# EAGLE design ESP32_LoRa_1_Channel_Gateway (EAGLE 9.6.2)
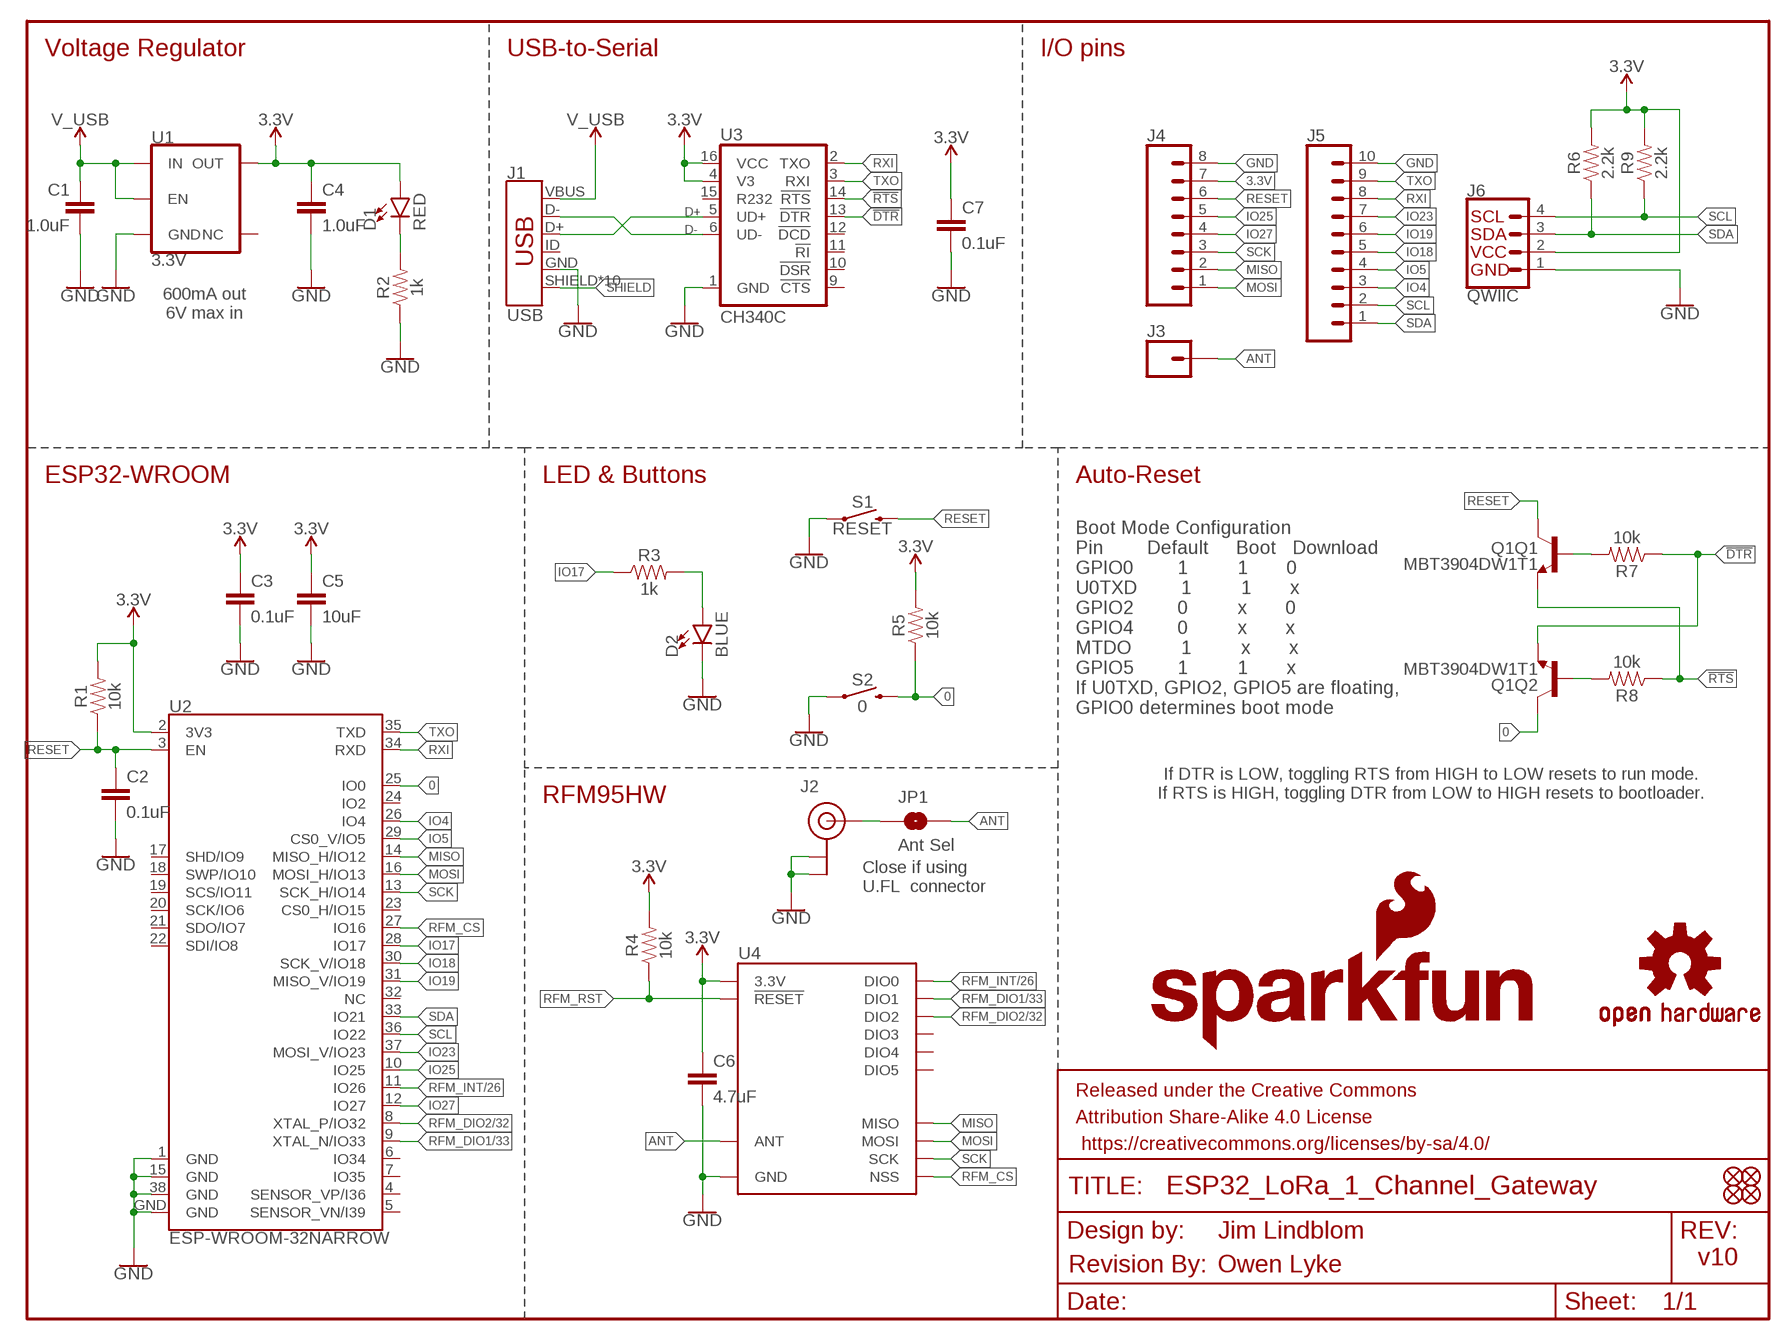
[diagram p0: schematic, sheet 1]

## Parts
C1  1.0uF  1.0UF-0603-16V-10%  [0603]
C2  0.1uF  0.1UF-0603-25V-(+80/-20%)  [0603]
C3  0.1uF  0.1UF-0603-25V-(+80/-20%)  [0603]
C4  1.0uF  1.0UF-0603-16V-10%  [0603]
C5  10uF  10UF-0603-6.3V-20%  [0603]
C6  4.7uF  4.7UF-0603-6.3V-(10%)  [0603]
C7  0.1uF  0.1UF-0603-25V-5%  [0603]
D1  RED  LED-RED0603  [LED-0603]
D2  BLUE  LED-BLUE0603  [LED-0603]
FD1  FIDUCIAL1X2  [FIDUCIAL-1X2]
FD2  FIDUCIAL1X2  [FIDUCIAL-1X2]
FD3  FIDUCIAL1X2  [FIDUCIAL-1X2]
FD4  FIDUCIAL1X2  [FIDUCIAL-1X2]
FRAME1  FRAME-LETTER  [CREATIVE_COMMONS]
J1  USB  USB_MICRO-B_HALF_PTH_MILL  [USB-MICROB-PTH-MILL]
J2  U.FL  [U.FL]
J3  CONN_01PTH_NO_SILK_YES_STOP  [1X01_NO_SILK]
J4  CONN_08NO_SILK_FEMALE_PTH  [1X08_NO_SILK]
J5  CONN_10NO_SILK_PTH_FEMALE  [1X10_NO_SILK]
J6  QWIIC  QWIIC_CONNECTORJS-1MM  [1X04_1MM_RA]
JP1  Ant Sel  JUMPER-SMT_2_NO_NO-SILK  [SMT-JUMPER_2_NO_NO-SILK]
LOGO1  REVISION  [REVISION]
LOGO2  SFE_LOGO_NAME_FLAME.1_INCH  [SFE_LOGO_NAME_FLAME_.1]
LOGO3  OSHW-LOGOS  [OSHW-LOGO-S]
Q1  MBT3904DW1T1  TRANS_NPN_DUAL-MBT3904DW1T1  [SC70-6]
R1  10k  10KOHM-0603-1/10W-1%  [0603]
R2  1k  1KOHM-0603-1/10W-1%  [0603]
R3  1k  1KOHM-0603-1/10W-1%  [0603]
R4  10k  10KOHM-0603-1/10W-1%  [0603]
R5  10k  10KOHM-0603-1/10W-1%  [0603]
R6  2.2k  2.2KOHM-0603-1/10W-1%  [0603]
R7  10k  10KOHM-0603-1/10W-1%  [0603]
R8  10k  10KOHM-0603-1/10W-1%  [0603]
R9  2.2k  2.2KOHM-0603-1/10W-1%  [0603]
S1  RESET  MOMENTARY-SWITCH-SPST-SMD-4.6X2.8MM  [TACTILE_SWITCH_SMD_4.6X2.8MM]
S2  0  MOMENTARY-SWITCH-SPST-SMD-4.6X2.8MM  [TACTILE_SWITCH_SMD_4.6X2.8MM]
U1  3.3V  V_REG_AP2112K-3.3V  [SOT23-5]
U2  ESP-WROOM-32NARROW  [ESP-WROOM-32-NARROW]
U3  CH340C  [SO016]
U4  RFM95W  [RFM95/96/97/98W]

## Nets
0: Q1.6(Q2:C) R5.1 S2.3 S2.4 U2.25(IO0)
3.3V: C3.1 C4.1 C5.1 C6.1 C7.1 D1.A J4.7 J6.2 R1.2 R4.2 R5.2 R6.2 R9.2 U1.5(OUT) U2.2(3V3) U3.4(V3) U3.16(VCC) U4.3.3V
!DTR: Q1.1(Q2:E) R7.1 U3.13(!DTR)
!RTS: Q1.4(Q1:E) R8.1 U3.14(!RTS)
ANT: J3.1 JP1.2 U4.ANT
D+: J1.D+ U3.5(UD+)
D-: J1.D- U3.6(UD-)
GND: C1.2 C2.2 C3.2 C4.2 C5.2 C6.2 C7.2 D2.C J1.GND J2.1(GND) J2.2(GND) J4.8 J5.10 J6.1 R2.1 S1.1 S1.2 S2.1 S2.2 U1.2(GND) U2.1(GND) U2.15(GND) U2.38(GND) U2.GND U3.1(GND) U4.GND@1(GND) U4.GND@2(GND) U4.GND@3(GND)
IO4: J5.3 U2.26(IO4)
IO5: J5.4 U2.29(CS0_V/IO5)
IO17: R3.1 U2.28(IO17)
IO18: J5.5 U2.30(SCK_V/IO18)
IO19: J5.6 U2.31(MISO_V/IO19)
IO23: J5.7 U2.37(MOSI_V/IO23)
IO25: J4.5 U2.10(IO25)
IO27: J4.4 U2.12(IO27)
MISO: J4.2 U2.14(MISO_H/IO12) U4.MISO
MOSI: J4.1 U2.16(MOSI_H/IO13) U4.MOSI
N$1: D1.C R2.2
N$2: D2.A R3.2
N$3: J2.FEED(SIGNAL) JP1.1
N$10: Q1.5(Q1:B) R7.2
N$12: Q1.2(Q2:B) R8.2
RESET: C2.1 J4.6 Q1.3(Q1:C) R1.1 S1.3 S1.4 U2.3(EN)
RFM_CS: U2.27(IO16) U4.NSS
RFM_DIO1/33: U2.9(XTAL_N/IO33) U4.DIO1
RFM_DIO2/32: U2.8(XTAL_P/IO32) U4.DIO2
RFM_INT/26: U2.11(IO26) U4.DIO0
RFM_RST: R4.1 U4.!RESET
RXI: J5.8 U2.34(RXD) U3.2(TXO)
SCK: J4.3 U2.13(SCK_H/IO14) U4.SCK
SCL: J5.2 J6.4 R9.1 U2.36(IO22)
SDA: J5.1 J6.3 R6.1 U2.33(IO21)
SHIELD: J1.SHIELD J1.SHIELD2(SHIELD) J1.SHIELD3(SHIELD) J1.SHIELD4(SHIELD) J1.SHIELD5(SHIELD) J1.SHIELD6(SHIELD) J1.SHIELD7(SHIELD) J1.SHIELD8(SHIELD) J1.SHIELD9(SHIELD) J1.SHIELD10(SHIELD)
TXO: J5.9 U2.35(TXD) U3.3(RXI)
V_USB: C1.1 J1.VBUS U1.1(IN) U1.3(EN)
Unconnected: J1.ID U1.4(NC) U2.4(SENSOR_VP/I36) U2.5(SENSOR_VN/I39) U2.6(IO34) U2.7(IO35) U2.17(SHD/IO9) U2.18(SWP/IO10) U2.19(SCS/IO11) U2.20(SCK/IO6) U2.21(SDO/IO7) U2.22(SDI/IO8) U2.23(CS0_H/IO15) U2.24(IO2) U2.32(NC) U3.9(!CTS) U3.10(!DSR) U3.11(!RI) U3.12(!DCD) U3.15(R232) U4.DIO3 U4.DIO4 U4.DIO5

## Notes on the sheet
- Voltage Regulator | USB-to-Serial | I/O pins
- 600mA out
  6V max in
- ESP32-WROOM | LED & Buttons | Auto-Reset
- Boot Mode Configuration
  Pin        Default     Boot   Download
  GPIO0        1         1       0
  U0TXD        1         1       x
  GPIO2        0         x       0
  GPIO4        0         x       x
  MTDO         1         x       x
  GPIO5        1         1       x
  If U0TXD, GPIO2, GPIO5 are floating, 
  GPIO0 determines boot mode
- If DTR is LOW, toggling RTS from HIGH to LOW resets to run mode.
  If RTS is HIGH, toggling DTR from LOW to HIGH resets to bootloader.
- RFM95HW
- Close if using
  U.FL  connector
- Jim Lindblom
- v10
- Owen Lyke

## Library data of the parts
C1 C4 = SparkFun-Capacitors:1.0UF: 1µF ceramic capacitors A capacitor is a passive two-terminal electrical component used to store electrical energy temporarily in an electric field.; PROD_ID: CAP-00868
C2 C3 = SparkFun-Capacitors:0.1UF: 0.1µF ceramic capacitors A capacitor is a passive two-terminal electrical component used to store electrical energy temporarily in an electric field.; PROD_ID: CAP-00810
C5 = SparkFun-Capacitors:10UF: 10.0µF ceramic capacitors A capacitor is a passive two-terminal electrical component used to store electrical energy temporarily in an electric field.; PROD_ID: CAP-11015
C6 = SparkFun-Capacitors:4.7UF: 4.7µF ceramic capacitors A capacitor is a passive two-terminal electrical component used to store electrical energy temporarily in an electric field.; PROD_ID: CAP-08280
C7 = SparkFun-Capacitors:0.1UF: 0.1µF ceramic capacitors A capacitor is a passive two-terminal electrical component used to store electrical energy temporarily in an electric field.; PROD_ID: CAP-08604
D1 = SparkFun-LED:LED-RED: Red SMD LED Used in manufacturing of most products at SparkFun Packages: 0603 - SMD 0603 package [Product Link] <http://docs.avagotech.com/docs/AV02-0551EN> 0603 SMART - SMD 0603 SMART package ( more efficient and expensive)[Product Link] <http://www.osram-os.com/Graphics/XPic2/00077099_0.pdf> 1206 - SMD1206 package [Product Link] <https://www.sparkfun.com/datasheets/DevTools/LilyPad/Q150OVS4.pdff> SparkFun Products: Pro Mini 328 -5V <https://www.sparkfun.com/products/821> RedBoard <https://www.sparkfun.com/products/12757> IOIO-OTG <https://www.sparkfun.com/products/13613>; PROD_ID: DIO-00819
D2 = SparkFun-LED:LED-BLUE: Blue SMD LED Used in manufacturing of various products at SparkFun Packages: 0603 - SMD 0603 package [Product Link] <http://www.digikey.com/product-detail/en/SMLE12BC7TT86/511-1589-2-ND/1641808> 1206 - SMD1206 package [Product Link] <http://www.digikey.com/product-detail/en/lite-on-inc/LTST-C150TBKT/160-1643-1-ND/573584> SparkFun Products: ESP8266 Thing-Dev Board <https://www.sparkfun.com/products/13711> RedBoard <https://www.sparkfun.com/products/12757>; PROD_ID: DIO-08575
FD1-FD4 = SparkFun-Aesthetics:FIDUCIAL: Fiducial Alignment Points Point-of-reference for pick-and-place machines and other optical instruments.
FRAME1 = SparkFun-Aesthetics:FRAME-LETTER: Schematic Frame - Letter Standard 8.5x11 US Letter frame
J1 = SparkFun-Connectors:USB_MICRO-B: USB Type Micro-B Connector Male/female and PTH/SMT variants SparkFun Products: SparkFun microB USB Breakout <https://www.sparkfun.com/products/12035> SparkFun USB microB Plug Breakout <https://www.sparkfun.com/products/10031> SparkFun ESP8266 Thing <https://www.sparkfun.com/products/13231>; PROD_ID: CONN-13711
J2 = SparkFun-Connectors:U.FL: SMD Antenna Connector - U.FL 2mm height, 3.0mm x 3.0mm receptacle size. SparkFun Products: SparkFun WiFi Shield - ESP8266 <https://www.sparkfun.com/products/13287> SparkFun ESP8266 Thing <https://www.sparkfun.com/products/13231> SparkFun MiniGen - Pro Mini Signal Generator Shield <https://www.sparkfun.com/products/11420>; PROD_ID: CONN-09193; SF_ID: WRL-09144
J3 = SparkFun-Connectors:CONN_01: Single connection point. Often used as Generic Header-pin footprint for 0.1 inch spaced/style header connections On any of the 0.1 inch spaced packages, you can populate with these: Break Away Headers - Straight <https://www.sparkfun.com/products/116> (PRT-00116) Break Away Male Headers - Right Angle <https://www.sparkfun.com/products/553> (PRT-00553) Female Headers <https://www.sparkfun.com/products/115> (PRT-00115) Break Away Headers - Machine Pin <https://www.sparkfun.com/products/117> (PRT-00117) Break Away Female Headers - Swiss Machine Pin <https://www.sparkfun.com/products/743> (PRT-00743) This device is also useful as a general connection point to wire up your design to another part of your project. Our various solder wires solder well into these plated through hole pads. Hook-Up Wire - Assortment (Stranded, 22 AWG) <https://www.sparkfun.com/products/11375> (PRT-11375) Hook-Up Wire - Assortment (Solid Core, 22 AWG) <https://www.sparkfun.com/products/11367> (PRT-11367) View the entire wire category on our website here <https://www.sparkfun.com/categories/141> Special notes: SMTSO-256-ET is a "flush mount" nut for a 4-40 screw. We mostly use this on specialty testbeds; it is a nice way to connect hardware to your PCB at an adjustable hieght. Also note, the SNAP packages are for using a snappable style connector. We sell a baggie of snaps and they are also used on two LilyPad designs: Snap Assortment - 30 pack (male and female) <https://www.sparkfun.com/products/11347> (DEV-11347) LilyPad Arduino SimpleSnap <https://www.sparkfun.com/products/10941> (DEV-10941) LilyPad SimpleSnap Protoboard <https://www.sparkfun.com/products/10940> (DEV-10940)
J4 = SparkFun-Connectors:CONN_08: Multi connection point. Often used as Generic Header-pin footprint for 0.1 inch spaced/style header connections On any of the 0.1 inch spaced packages, you can populate with these: Break Away Headers - Straight <https://www.sparkfun.com/products/116> (PRT-00116) Break Away Male Headers - Right Angle <https://www.sparkfun.com/products/553> (PRT-00553) Female Headers <https://www.sparkfun.com/products/115> (PRT-00115) Break Away Headers - Machine Pin <https://www.sparkfun.com/products/117> (PRT-00117) Break Away Female Headers - Swiss Machine Pin <https://www.sparkfun.com/products/743> (PRT-00743) Arduino Stackable Header - 8 Pin <https://www.sparkfun.com/products/9279> (PRT-09279) For SCREWTERMINALS and SPRING TERMINALS visit here: Screw Terimnals on SparkFun.com <https://www.sparkfun.com/search/results?term=Screw+Terminals> (5mm/3.5mm/2.54mm spacing) This device is also useful as a general connection point to wire up your design to another part of your project. Our various solder wires solder well into these plated through hole pads. Hook-Up Wire - Assortment (Stranded, 22 AWG) <https://www.sparkfun.com/products/11375> (PRT-11375) Hook-Up Wire - Assortment (Solid Core, 22 AWG) <https://www.sparkfun.com/products/11367> (PRT-11367) View the entire wire category on our website here <https://www.sparkfun.com/categories/141> Special notes: Molex polarized connector foot print use with SKU : PRT-08231 with associated crimp pins and housings. 1MM SMD Version SKU: PRT-10208 NOTES ON THE VARIANTS LOCK and LOCK_LONGPADS... This footprint was designed to help hold the alignment of a through-hole component (i.e. 6-pin header) while soldering it into place. You may notice that each hole has been shifted either up or down by 0.005 of an inch from it's more standard position (which is a perfectly straight line). This slight alteration caused the pins (the squares in the middle) to touch the edges of the holes. Because they are alternating, it causes a "brace" to hold the component in place. 0.005 has proven to be the perfect amount of "off-center" position when using our standard breakaway headers. Although looks a little odd when you look at the bare footprint, once you have a header in there, the alteration is very hard to notice. Also,if you push a header all the way into place, it is covered up entirely on the bottom side.; PROD_ID: CONN-08438
J5 = SparkFun-Connectors:CONN_10: Multi connection point. Often used as Generic Header-pin footprint for 0.1 inch spaced/style header connections On any of the 0.1 inch spaced packages, you can populate with these: Break Away Headers - Straight <https://www.sparkfun.com/products/116> (PRT-00116) Break Away Male Headers - Right Angle <https://www.sparkfun.com/products/553> (PRT-00553) Female Headers <https://www.sparkfun.com/products/115> (PRT-00115) Break Away Headers - Machine Pin <https://www.sparkfun.com/products/117> (PRT-00117) Break Away Female Headers - Swiss Machine Pin <https://www.sparkfun.com/products/743> (PRT-00743) Arduino Stackable Header - 10 Pin <https://www.sparkfun.com/products/11376> (PRT-11376) For SCREWTERMINALS and SPRING TERMINALS visit here: Screw Terimnals on SparkFun.com <https://www.sparkfun.com/search/results?term=Screw+Terminals> (5mm/3.5mm/2.54mm spacing) This device is also useful as a general connection point to wire up your design to another part of your project. Our various solder wires solder well into these plated through hole pads. Hook-Up Wire - Assortment (Stranded, 22 AWG) <https://www.sparkfun.com/products/11375> (PRT-11375) Hook-Up Wire - Assortment (Solid Core, 22 AWG) <https://www.sparkfun.com/products/11367> (PRT-11367) View the entire wire category on our website here <https://www.sparkfun.com/categories/141> Special notes: Molex polarized connector foot print use with SKU : PRT-08231 with associated crimp pins and housings. 1MM SMD Version SKU: PRT-10208 NOTES ON THE VARIANTS LOCK and LOCK_LONGPADS... This footprint was designed to help hold the alignment of a through-hole component (i.e. 6-pin header) while soldering it into place. You may notice that each hole has been shifted either up or down by 0.005 of an inch from it's more standard position (which is a perfectly straight line). This slight alteration caused the pins (the squares in the middle) to touch the edges of the holes. Because they are alternating, it causes a "brace" to hold the component in place. 0.005 has proven to be the perfect amount of "off-center" position when using our standard breakaway headers. Although looks a little odd when you look at the bare footprint, once you have a header in there, the alteration is very hard to notice. Also,if you push a header all the way into place, it is covered up entirely on the bottom side.; PROD_ID: CONN-11563
J6 = SparkFun-Connectors:QWIIC_CONNECTOR: SparkFun I2C Standard Qwiic Connector An SMD 1mm pitch JST connector makes it easy and quick (get it? Qwiic?) to connect I2C devices to each other. The Qwiic system <http://www.sparkfun.com/qwiic> enables fast and solderless connection between popular platforms and various sensors and actuators. We carry 200mm <https://www.sparkfun.com/products/14204>, 100mm <https://www.sparkfun.com/products/14205>, 50mm <https://www.sparkfun.com/products/14206>, and breadboard friendly <https://www.sparkfun.com/products/14207> Qwiic cables. We also offer 10 pcs strips <https://www.sparkfun.com/products/14323> the SMD connectors.; PROD_ID: CONN-13694
JP1 = SparkFun-Jumpers:JUMPER-SMT_2_NO: Normally open jumper This jumper has two pads in close proximity to each other. Apply solder to close the connection. Round pads are easier to solder for beginners, but are a lot larger. SparkFun Product that uses the round pads: SparkFun EL Sequencer <https://www.sparkfun.com/products/12781>
LOGO1 = SparkFun-Aesthetics:REVISION: "Revision By" Text Preceding text for revisor documentation. Includes schematic text on "symbols" layer, and board text on tDoc.
LOGO2 = SparkFun-Aesthetics:SFE_LOGO_NAME_FLAME: SparkFun Font Logo w/ Flame This is the SparkFun full logo. The logo on the schematic will always be the same size; the package variant is the height of the flame part of the logo. Default layer for the logo on the board is tSilk.
LOGO3 = SparkFun-Aesthetics:OSHW-LOGO: Open-Source Hardware (OSHW) Logo This logo indicates the piece of hardware it is found on incorporates a OSHW license and/or adheres to the definition of open source hardware found here: http://freedomdefined.org/OSHW
Q1 = SparkFun-DiscreteSemi:TRANS_NPN_DUAL: Dual NPN Transistors in Single Package The MBT3904W1 puts two general purpose 3904 NPN transistors in a single package. Datasheet <http://www.onsemi.com/pub_link/Collateral/MBT3904DW1T1-D.PDF> SparkFun Products: SparkFun ESP32 Thing <https://www.sparkfun.com/products/13907>; PROD_ID: TRANS-13337
R1 R4 R5 R7 R8 = SparkFun-Resistors:10KOHM: 10kΩ resistor A resistor is a passive two-terminal electrical component that implements electrical resistance as a circuit element. Resistors act to reduce current flow, and, at the same time, act to lower voltage levels within circuits. - Wikipedia; PROD_ID: RES-00824
R2 R3 = SparkFun-Resistors:1KOHM: 1kΩ resistor A resistor is a passive two-terminal electrical component that implements electrical resistance as a circuit element. Resistors act to reduce current flow, and, at the same time, act to lower voltage levels within circuits. - Wikipedia; PROD_ID: RES-07856
R6 R9 = SparkFun-Resistors:2.2KOHM: 2.2kΩ resistor A resistor is a passive two-terminal electrical component that implements electrical resistance as a circuit element. Resistors act to reduce current flow, and, at the same time, act to lower voltage levels within circuits. - Wikipedia; PROD_ID: RES-08272
S1 S2 = SparkFun-Switches:MOMENTARY-SWITCH-SPST: Momentary Switch (Pushbutton) - SPST Normally-open (NO) SPST momentary switches (buttons, pushbuttons). Variants PTH-12MM - 12mm square, through-hole Momentary Pushbutton Switch - 12mm Square <https://www.sparkfun.com/products/9190> (COM-09190) PTH-6.0MM, PTH-6.0MM-KIT - 6.0mm square, through-hole Mini Pushbutton Switch <https://www.sparkfun.com/products/97> (COM-00097) KIT package intended for soldering kit's - only one side of pads' copper is exposed. PTH-RIGHT-ANGLE-KIT - Right-angle, through-hole Right Angle Tactile Button <https://www.sparkfun.com/products/10791> - Used on SparkFun BigTime Watch Kit <https://www.sparkfun.com/products/11734> SMD-12MM - 12mm square, surface-mount Tactile Button - SMD (12mm) <https://www.sparkfun.com/products/12993> (COM-12993) Used on SparkFun PicoBoard <https://www.sparkfun.com/products/11888> SMD-4.5MM - 4.5mm Square Trackball Switch Used on SparkFun Blackberry Trackballer Breakout <https://www.sparkfun.com/products/13169> SMD-4.6MMX2.8MM - 4.60mm x 2.80mm, surface mount Used on SparkFun Pro Micro - RP2040 <https://www.sparkfun.com/products/17717> SMD-5.2MM, SMD-5.2-REDUNDANT - 5.2mm square, surface-mount Mini Pushbutton Switch - SMD <https://www.sparkfun.com/products/8720> (COM-08720) Used on Arduino Pro Mini <https://www.sparkfun.com/products/11114> REDUNDANT package connects both switch circuits together SMD-6.0X3.5MM - 6.0 x 3.5mm, surface mount Momentary Reset Switch SMD <https://www.sparkfun.com/products/8229> (COM-08229) SMD-6.2MM-TALL - 6.2mm square, surface mount Tactile Button - SMD (6mm) <https://www.sparkfun.com/products/12992> Used on SparkFun Digital Sandbox <https://www.sparkfun.com/products/12651> SMD-RIGHT-ANGLE - Right-angle, surface mount Used on SparkFun Block for Intel® Edison - Arduino <https://www.sparkfun.com/products/13036>; PROD_ID: SWCH-15606
U1 = SparkFun-IC-Power:V_REG_AP2112: AP2112 - 600mA CMOS LDO Regulator w/ Enable The AP2112 is CMOS process low dropout linear regulator with enable function, the regulator delivers a guaranteed 600mA (min.) continuous load current. Features Output Voltage Accuracy: ±1.5% Output Current: 600mA (Min.) Foldback Short Current Protection: 50mA Enable Function to Turn ON/OFF VOUT Low Dropout Voltage (3.3V): 250mV (Typ.) @IOUT=600mA Excellent Load Regulation: 0.2%/A (Typ.) Excellent Line Regulation: 0.02%/V (Typ.) Low Quiescent Current: 55μA (Typ.) Low Standby Current: 0.01μA (Typ.) Low Output Noise: 50μVRMS PSRR: 100Hz -65dB, 1kHz -65dB OTSD Protection Stable with 1.0μF Flexible Cap: Ceramic, Tantalum and Aluminum Electrolytic Operation Temperature Range: -40°C to 85°C ESD: MM 400V, HBM 4000V; PROD_ID: VREG-12457
U2 = SparkFun-RF:ESP-WROOM-32; PROD_ID: IC-15676
U3 = SparkFun-IC-Comms:CH340C; PROD_ID: IC-14038
U4 = SparkFun-RF:RFM95W: RFM95/96/97/98 The RFM95/96/97/98(W) transceivers feature the LoRaTM long range modem that provides ultra-long range spread spectrum communication and high interference immunity whilst minimising current consumption. These devices also support high performance (G)FSK modes for systems including WMBus, IEEE802.15.4g. The RFM95/96/97/98(W) deliver exceptional phase noise, selectivity, receiver linearity and IIP3 for significantly lower current consumption than competing devices Datasheet <http://www.hoperf.com/upload/rf/RFM95_96_97_98W.pdf>; PROD_ID: IC-13959

## Net classes
0 default: width 0.152 mm, drill 0.305 mm
1 power: width 0.178 mm

## Board
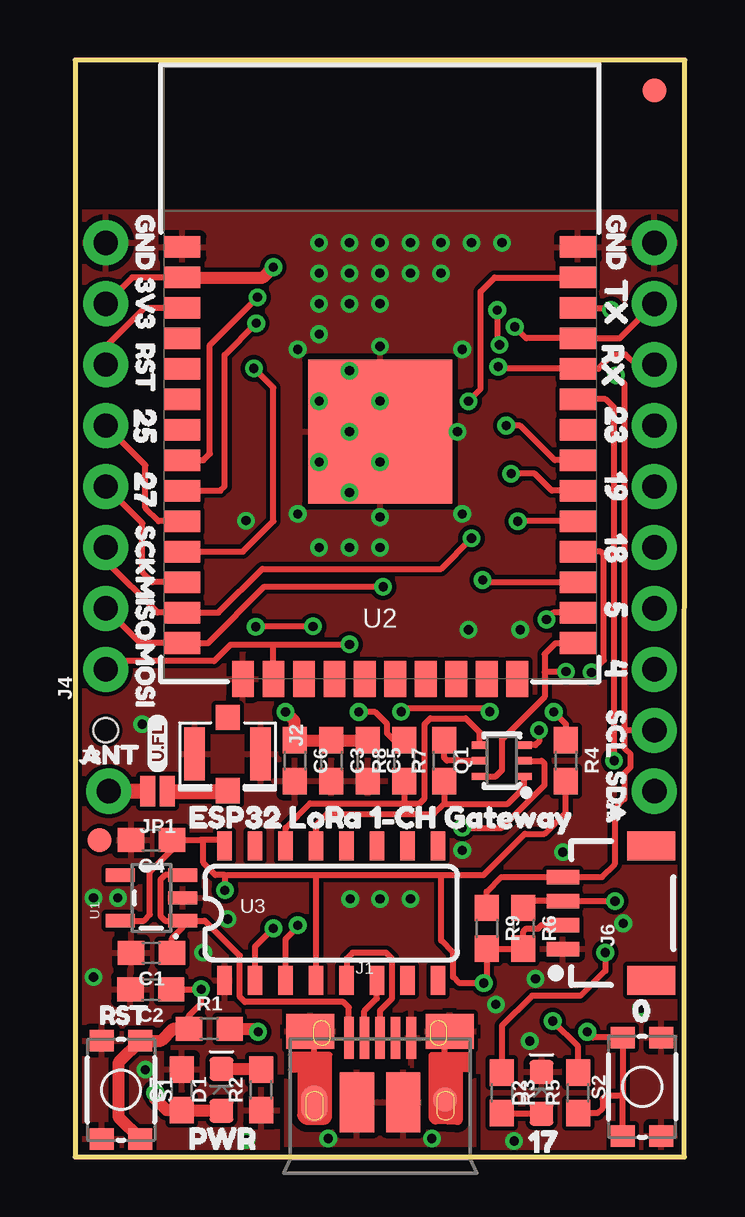
[diagram p1: board, top side]
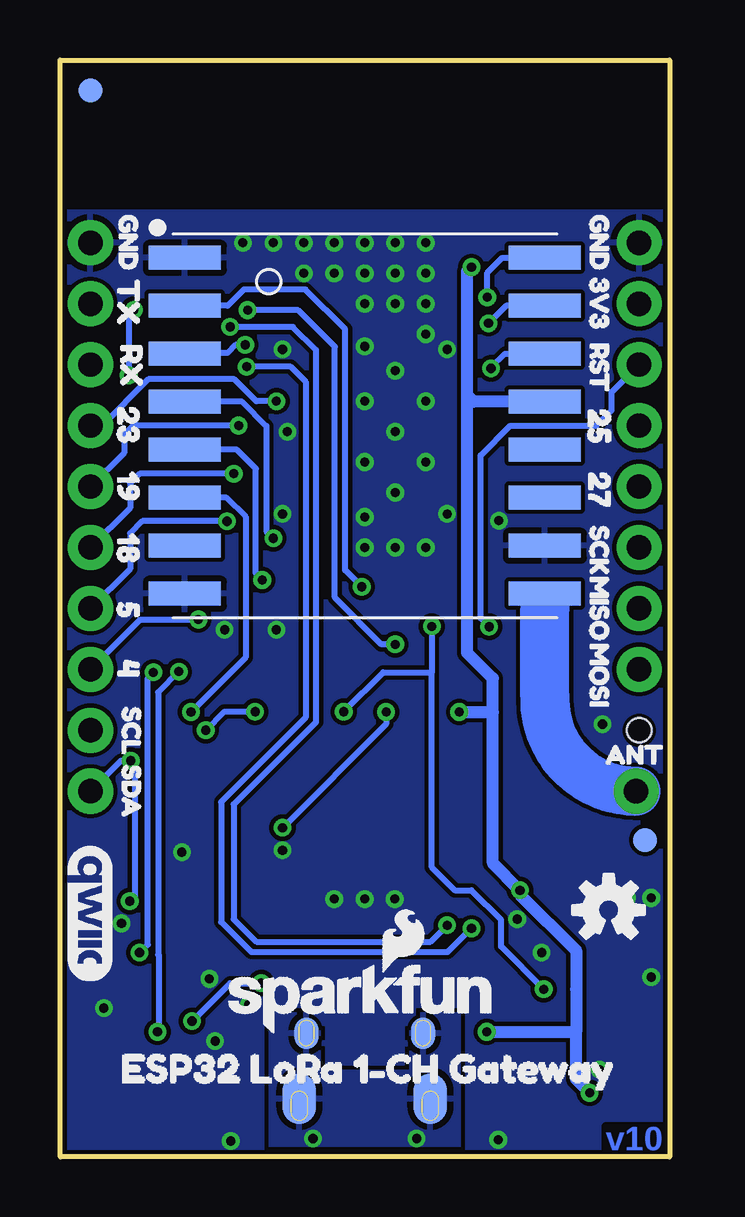
[diagram p2: board, bottom side, seen from below]

Size 25.4 x 45.72 mm. Coordinates in mm from the lower left corner, seen from the top.
Outline: 0,0 25.38,0 25.4,45.72 0,45.72 0,0
Copper layers (1*16): Top 0.035mm / dielectric 1.5mm / Bottom 0.035mm
Design rules "SparkFun-2-layer-TIGHT": minimum track width 7mil, minimum drill 15mil, track to track 7mil, track to pad 7mil, pad to pad 7mil, via to via 7mil, smd to smd 7mil, copper to edge 7mil, drill to drill 7mil, minimum pad ring 7mil, minimum via ring 7mil, stop-mask expansion 4mil, vias tented up to drill 25mil, thermal gap 10mil
Holes 1.02 mm at 1.27,17.78

### Footprints (pad centres in the part's own frame; a part is rotated, then mirrored left to right if it is on the bottom)
0603 = smd 1.1 x 1: 1 -0.85,0; 2 0.85,0
LED-0603 = smd 1 x 1: A -0.877,0; C 0.877,0
FIDUCIAL-1X2 = smd 1 x 1: 1 0,0
USB-MICROB-PTH-MILL = smd 0.4 x 1.75: D+ 0,0; D- -0.65,0; GND 1.3,0; ID 0.65,0; VBUS -1.3,0 | smd 2 x 1.46: SHIELD -2.9,0.275; SHIELD2 2.9,0.275 | smd 1.425 x 2.5: SHIELD3 -0.963,-2.675; SHIELD4 0.963,-2.675 | smd 1.4 x 2.1 bottom: SHIELD5 -2.731,-2.531; SHIELD7 2.729,-2.531 | smd 1 x 1: SHIELD6 2.7,-2.575 | smd 1.1 x 1.5: SHIELD8 -2.731,-2.731 | smd 1 x 1.3 bottom: SHIELD9 -2.43,0.195; SHIELD10 2.43,0.195
U.FL = smd 2.2 x 0.85: 1 0,1.375; 2 0,-1.375 | smd 1.05 x 1: FEED 1.525,0; NC -1.525,0
1X01_NO_SILK = drill 1.016 pad 1.88: 1 0,0
1X08_NO_SILK = drill 1.016 pad 1.88: 1 0,0; 2 2.54,0; 3 5.08,0; 4 7.62,0; 5 10.16,0; 6 12.7,0; 7 15.24,0; 8 17.78,0
1X10_NO_SILK = drill 1.016 pad 1.88: 1 0,0; 2 2.54,0; 3 5.08,0; 4 7.62,0; 5 10.16,0; 6 12.7,0; 7 15.24,0; 8 17.78,0; 9 20.32,0; 10 22.86,0
1X04_1MM_RA = smd 0.6 x 1.35: 1 -1.5,0; 2 -0.5,0; 3 0.5,0; 4 1.5,0 | smd 1.2 x 2: NC1 2.8,-3.675; NC2 -2.8,-3.675
SMT-JUMPER_2_NO_NO-SILK = smd 0.635 x 1.27: 1 -0.406,0; 2 0.406,0
SC70-6 = smd 0.3 x 0.66: 1 -0.65,-0.92; 2 0,-0.92; 3 0.65,-0.92; 4 0.65,0.92; 5 0,0.92; 6 -0.65,0.92
TACTILE_SWITCH_SMD_4.6X2.8MM = smd 0.9 x 1: 1 -2.05,-0.8; 2 2.05,-0.8; 3 2.05,0.8; 4 -2.05,0.8
SOT23-5 = smd 0.55 x 1.2: 1 -0.95,-1.3; 2 0,-1.3; 3 0.95,-1.3; 4 0.95,1.3; 5 -0.95,1.3
ESP-WROOM-32-NARROW = smd 0.9 x 1.5: 1 6.43,8.238; 2 5.16,8.238; 3 3.89,8.238; 4 2.62,8.238; 5 1.35,8.238; 6 0.08,8.238; 7 -1.19,8.238; 8 -2.46,8.238; 9 -3.73,8.238; 10 -5,8.238; 11 -6.27,8.238; 12 -7.54,8.238; 13 -8.81,8.238; 14 -10.08,8.238; 25 -10.08,-8.238; 26 -8.81,-8.238; 27 -7.54,-8.238; 28 -6.27,-8.238; 29 -5,-8.238; 30 -3.73,-8.238; 31 -2.46,-8.238; 32 -1.19,-8.238; 33 0.08,-8.238; 34 1.35,-8.238; 35 2.62,-8.238; 36 3.89,-8.238; 37 5.16,-8.238; 38 6.43,-8.238 | smd 1.5 x 0.9: 15 -11.57,5.715; 16 -11.57,4.445; 17 -11.57,3.175; 18 -11.57,1.905; 19 -11.57,0.635; 20 -11.57,-0.635; 21 -11.57,-1.905; 22 -11.57,-3.175; 23 -11.57,-4.445; 24 -11.57,-5.715 | smd 6 x 6: GND -1.27,0
SO016 = smd 0.6 x 1.2: 1 -4.445,-2.8; 2 -3.175,-2.8; 3 -1.905,-2.8; 4 -0.635,-2.8; 5 0.635,-2.8; 6 1.905,-2.8; 7 3.175,-2.8; 8 4.445,-2.8; 9 4.445,2.8; 10 3.175,2.8; 11 1.905,2.8; 12 0.635,2.8; 13 -0.635,2.8; 14 -1.905,2.8; 15 -3.175,2.8; 16 -4.445,2.8
RFM95/96/97/98W = smd 3 x 1: 3.3V 7.5,1; !RESET -7.5,-3; ANT 7.5,-7; DIO0 7.5,3; DIO1 7.5,5; DIO2 7.5,7; DIO3 7.5,-3; DIO4 7.5,-1; DIO5 -7.5,-5; GND@1 -7.5,7; GND@2 -7.5,-7; GND@3 7.5,-5; MISO -7.5,5; MOSI -7.5,3; NSS -7.5,-1; SCK -7.5,1

### Placement (x,y rotation side)
C1  3.17,8.51 180 top
C2  3.15,6.99 180 top
C3  10.67,16.51 270 top
C4  3.17,13.21 180 top
C5  12.19,16.51 270 top
C6  9.14,16.51 270 top
C7  4.45,2.79 90 top
D1  6.1,2.79 90 top
D2  19.43,2.67 90 top
FD1  24.13,44.45 0 bottom
FD2  1.02,13.21 0 top
FD3  24.13,44.45 0 top
FD4  1.02,13.21 0 bottom
FRAME1  -4.95,-9.91 0 top  (outside the outline)
J1  12.7,4.95 0 top
J2  6.35,16.79 270 top
J3  1.4,15.24 0 top
J4  1.27,20.32 90 top
J5  24.13,15.24 90 top
J6  20.32,10.16 90 top
JP1  3.43,15.24 180 top
LOGO1  6.48,-12.95 0 top  (outside the outline)
LOGO2  18.8,5.08 0 bottom
LOGO3  2.54,10.29 0 bottom
Q1  17.78,16.51 90 top
R1  5.59,5.33 0 top
R2  7.75,2.79 90 top
R3  17.78,2.67 270 top
R4  20.45,16.51 270 top
R5  20.95,2.67 90 top
R6  18.67,9.53 270 top
R7  15.37,16.51 90 top
R8  13.72,16.51 90 top
R9  17.14,9.53 270 top
S1  1.91,2.79 270 top
S2  23.62,2.92 90 top
U1  3.17,10.79 90 top
U2  12.7,31.5 90 top
U3  10.67,10.16 0 top
U4  12.7,30.48 0 bottom
U$1  [GND0]  2.92,39.94 270 top
U$2  [3V31]  2.92,37.34 270 top
U$3  [RST2]  2.92,34.61 270 top
U$4  [2517]  2.92,32 270 top
U$5  [279]  2.92,29.34 270 top
U$6  [SCK3]  2.92,26.99 270 top
U$7  [MISO4]  2.92,24.89 270 top
U$8  [MOSI5]  2.92,22.1 270 top
U$9  [ANT6]  -0.48,16.76 0 top
U$10  [GND0]  22.54,39.94 270 top
U$11  [TX16]  22.54,37.34 270 top
U$12  [RX15]  22.42,34.67 270 top
U$13  [2314]  22.54,32.07 270 top
U$14  [1912]  22.54,29.34 270 top
U$15  [1811]  22.54,26.8 270 top
U$16  [513]  22.54,23.94 270 top
U$17  [410]  22.54,21.53 270 top
U$18  [SCL8]  22.54,19.3 270 top
U$19  [SDA7]  22.54,16.76 270 top
U$20  [RST2]  0.32,5.91 0 top
U$21  [020]  22.42,6.1 0 top
U$22  [PWR19]  3.94,0.76 0 top
U$23  [1722]  18.1,0.64 0 top
U$24  [U#FL0]  3.43,16 90 top
U$25  [ESP32_LORA_1#CH_GATEWAY21]  3.94,14.16 0 top
U$26  [GND0]  22.54,39.94 270 bottom
U$27  [TX16]  22.54,37.34 270 bottom
U$28  [RX15]  22.42,34.67 270 bottom
U$29  [2314]  22.54,32.07 270 bottom
U$30  [1912]  22.54,29.34 270 bottom
U$31  [1811]  22.54,26.8 270 bottom
U$32  [513]  22.54,23.94 270 bottom
U$33  [410]  22.54,21.53 270 bottom
U$34  [SCL8]  22.42,19.43 270 bottom
U$35  [SDA7]  22.42,17.02 270 bottom
U$36  [ANT6]  3.4,16.76 0 bottom
U$37  [GND0]  2.92,39.94 270 bottom
U$38  [3V31]  2.92,37.34 270 bottom
U$39  [RST2]  2.92,34.61 270 bottom
U$40  [2517]  2.92,32 270 bottom
U$41  [279]  2.92,29.34 270 bottom
U$42  [SCK3]  2.92,26.99 270 bottom
U$43  [MISO4]  2.92,24.89 270 bottom
U$44  [MOSI5]  2.92,22.1 270 bottom
U$45  [ESP32_LORA_1#CH_GATEWAY23]  23.88,3.68 0 bottom
U$46  [QWIIC_COPYRIGHT_SMALL]  24.13,10.16 270 bottom

### Tracks (layer width: path | path; a pad name or v marks a point on that pad's centre or on a via)
0  (via drill 0.38)
  Top 0.254: R5.1 21.76,1.82 21.97,2.03 21.97,2.41 22.1,2.54 22.82,2.54 | U2.25 20.02,21.42 19.56,20.95 19.56,20.19 | 19.56,20.19 19.56,19.18 17.79,17.41 17.79,16.12 17.53,15.86 Q1.6 | 19.56,20.19 19.59,20.22 v20.45,20.22 | v21.34,5.21 21.57,4.97 S2.3 22.82,2.54 | S2.4 22.82,2.54
  Bottom 0.254: v20.45,20.22 21.31,19.36 21.31,8.43 21.29,8.41 21.29,5.26 v21.34,5.21
3.3V  (via drill 0.38)
  Top 0.254: J4.7 2.37,36.66 U2.2 | R5.2 20.95,4.6 v19.9,5.66 | 6.22,11.74 5.84,11.74 5.33,12.25 5.33,13.21 | 6.22,11.74 10.03,11.74 | 10.03,11.74 15.24,11.74 | 6.22,11.74 6.22,11.12 v6.24,11.11 | U3.16 5.97,13.21 5.33,13.21 | 5.33,13.21 5.21,13.21 C4.1 4.03,12.79 3.11,11.87 3.11,10.1 2.86,9.85 U1.5 | U3.4 10.03,11.74 | 15.24,11.74 15.24,9.02 15.75,8.51 15.75,7.49 16,7.24 v17.02,7.24 17.14,7.37 R9.2 R6.2 18.67,9.39 18.8,9.52 19.3,9.52 19.43,9.66 J6.2 | 15.24,11.74 17.02,11.74 18.73,13.46 19.56,13.46 20.45,14.35 R4.2
  Top 0.508: v8.26,37.08 7.83,36.66 U2.2 | v8.76,18.54 9.14,18.16 C6.1 C3.1 C5.1 | R1.2 7.49,5.33 v7.62,5.21 | D1.A 4.47,1.92 C7.1 3.81,1.94 3.34,2.41 3.33,2.41 v3.33,2.67
  Bottom 0.254: v17.02,7.24 18.31,7.24 v19.9,5.66
  Bottom 0.508: v8.26,37.08 8.43,36.91 8.43,31.75 | 7.37,18.54 7.37,19.94 8.43,21.01 8.43,31.75 | v8.76,18.54 7.37,18.54 | 7.37,18.54 7.37,12.24 v6.24,11.11 6.24,10.95 3.9,8.61 3.9,6.99 3.9,5.21 | v7.62,5.21 3.9,5.21 | v3.33,2.67 3.9,3.23 3.9,5.21 | U4.3.3V 8.16,31.48 8.43,31.75
!DTR
  Top 0.254: Q1.1 18.7,15.4 18.02,14.72 15.37,14.72 | R7.1 15.37,14.72 | U3.13 10.03,13.84 10.49,14.3 14.95,14.3 15.37,14.72
!RTS
  Top 0.254: Q1.4 16.86,17.68 16.27,18.27 14.8,18.27 14.56,18.04 14.56,14.94 14.35,14.73 13.72,14.73 | R8.1 13.72,14.73 | U3.14 8.76,13.72 9.78,14.73 13.72,14.73
ANT
  Top 0.635: JP1.2 J3.1
  Bottom 1.016: 5.2,22.86 U4.ANT | 5.2,19.17 5.2,19.04
  Bottom 2.032: 5.2,19.04 arc-90 J3.1 | 5.2,19.17 5.2,22.86
D+
  Top 0.254: J1.D+ 12.7,6.1 13.21,6.6 13.21,8.26 12.95,8.51 11.56,8.51 11.3,8.26 U3.5
D-
  Top 0.254: J1.D- 12.05,6.08 12.57,6.6 U3.6
GND  (via drill 0.38)
  other vias: 12.7,33.78 12.7,26.67 17.78,38.1 9.27,26.8 9.27,33.66 16.51,38.1 16.13,33.66 2.92,3.63 18.94,4.83 23.57,6.2 7.11,26.52 15.93,30.23 16.13,26.8 7.14,0.71 19.18,7.42 10.16,25.4 0.76,10.79 1.78,10.79 15.24,38.1 13.97,38.1 12.7,38.1 11.43,38.1 10.16,38.1 15.24,36.83 13.97,36.83 12.7,36.83 11.43,36.83 10.16,36.83 12.7,35.56 11.43,35.56 10.16,35.56 10.16,34.29 0.76,7.49 18.54,21.97 16.38,21.97 11.43,25.4 12.7,25.4 2.79,18.03 11.46,10.74 12.7,10.74 13.97,10.74 17.53,6.35 16.13,12.78 20.32,12.7 18.29,0.66 22.83,9.73 5.33,8.51 11.43,32.77 12.7,31.5 10.16,31.5 11.43,30.23 12.7,28.96 10.16,28.96 11.43,27.69 6.35,9.91
  pour Top (isolate 0.152, rank 6): 0,0 0,39.37 25.4,39.37 25.4,0
  pour Bottom (isolate 0.152, rank 6): 25.4,0 25.4,39.37 0,39.37 0,0
IO4  (via drill 0.38)
  Top 0.254: U2.26 19.92,22.69 v19.63,22.4
  Bottom 0.254: J5.3 22.05,22.4 v19.63,22.4
IO5  (via drill 0.38)
  Top 0.254: U2.29 v18.44,26.5 v18.44,26.49
  Bottom 0.254: v18.44,26.49 21.97,26.49 22.48,25.98 22.48,24.51 J5.4
IO17  (via drill 0.38)
  Top 0.254: R3.1 17.78,5.46 19.04,6.72 21.06,6.72 22.09,7.75 v22.09,8.51 | U2.28 21.89,25.23 22.02,25.09 22.02,20.7 v21.51,20.19
  Bottom 0.254: v22.09,8.51 21.74,8.85 21.74,19.96 v21.51,20.19
IO18  (via drill 0.38)
  Top 0.254: U2.30 19.86,27.77 19.15,28.47 v18.16,28.47
  Bottom 0.254: v18.16,28.47 22.07,28.47 22.48,28.07 22.48,27.05 J5.5
IO19  (via drill 0.38)
  Top 0.254: U2.31 19.99,29.04 18.54,30.48 v17.96,30.48
  Bottom 0.254: v17.96,30.48 22.35,30.48 22.73,30.1 22.73,29.34 J5.6
IO23  (via drill 0.38)
  Top 0.254: v16.38,31.5 16.89,32 16.89,36.07 17.48,36.66 U2.37
  Bottom 0.254: v16.38,31.5 17.22,31.5 18.14,32.41 21.72,32.41 23.65,30.48 J5.7
IO25
  Top 0.254: U2.10 3.48,26.5 2.92,27.05 2.92,28.83 J4.5
IO27
  Top 0.254: U2.12 3.22,23.96 2.79,24.38 2.79,26.42 J4.4
MISO  (via drill 0.38)
  Top 0.254: J4.2 2.71,21.42 U2.14 5.54,21.42 7.88,23.76 v12.83,23.76
  Bottom 0.254: U4.MISO 18.41,35.48 17.74,36.16 15.18,36.16 13.52,34.5 13.52,24.45 v12.83,23.76
MOSI  (via drill 0.38)
  Top 0.254: 8.26,21.35 6.48,21.35 5.79,20.66 1.61,20.66 J4.1 | 8.26,21.35 11.42,21.35 v11.43,21.36 | U2.16 8.26,21.35 | v17.58,35.29 17.58,33.94 v17.68,33.85
  Bottom 0.254: v11.43,21.36 12.01,21.36 13.95,23.31 13.95,33.76 15.48,35.29 v17.58,35.29 | U4.MOSI 20.18,33.5 18.41,33.5 18.07,33.85 v17.68,33.85
N$1
  Top 0.508: R2.2 6.12,3.64 D1.C
N$2
  Top 0.254: D2.A 17.81,1.79 R3.2
N$3
  Top 0.635: JP1.1 6.33,15.24 arc90 J2.FEED
N$10
  Top 0.254: R7.2 15.37,16.64 15.49,16.52 15.99,16.52 16,16.51 Q1.5
N$12  (via drill 0.38)
  Top 0.254: Q1.2 19.43,16.51 19.56,16.38 19.56,15.49 17.78,13.72 v16.13,13.72 | R8.2 13.29,17.36 13,17.65 13,18.04 12.49,18.54 v11.81,18.54
  Bottom 0.254: v16.13,13.72 11.81,18.03 v11.81,18.54
RESET  (via drill 0.38)
  Top 0.254: U2.3 2.87,35.39 1.27,33.78 J4.6 | v9.91,22.11 7.53,22.11 v7.52,22.1 | v17.27,18.55 17.12,18.71 13.73,18.71 v13.58,18.55 | Q1.3 19.18,17.16 19.32,17.31 v19.32,17.78 | R1.1 4.74,5.88 5.25,6.39 v5.25,6.99 C2.1
  Top 0.508: R1.1 4.06,5.33 3.57,4.84 S1.4 1.82,3.96 1.82,1.63 S1.3
  Bottom 0.254: v9.91,22.11 9.91,20.19 | 9.91,20.19 9.91,12.06 8.95,11.11 8.26,11.11 7.02,9.88 7.02,8.76 v5.25,6.99 | J4.6 2.41,31.88 2.41,31.11 3.05,30.48 6.63,30.48 7.87,29.24 7.87,22.45 v7.52,22.1 | v13.58,18.55 11.94,20.19 9.91,20.19 | v19.32,17.78 18.55,18.55 v17.27,18.55
RFM_CS  (via drill 0.38)
  Top 0.254: U2.27 17.07,23.96 v16.98,24.05
  Bottom 0.254: U4.NSS 18.03,29.48 17.23,28.68 17.23,24.3 v16.98,24.05
RFM_DIO1/33  (via drill 0.38)
  Top 0.254: U2.9 6.05,27.77 6.22,27.94 6.22,33.43 v7.54,34.75
  Bottom 0.254: U4.DIO1 6.81,35.48 v7.54,34.75
RFM_DIO2/32  (via drill 0.38)
  Top 0.254: U2.8 5.33,29.04 5.61,29.31 5.61,33.84 v7.59,35.83
  Bottom 0.254: U4.DIO2 6.97,37.48 7.59,36.85 v7.59,35.83
RFM_INT/26  (via drill 0.38)
  Top 0.254: v7.44,32.87 8.26,32.05 8.26,26.5 6.99,25.23 U2.11
  Bottom 0.254: U4.DIO0 6.86,33.48 7.44,32.9 v7.44,32.87
RFM_RST  (via drill 0.38)
  Top 0.254: v19.94,18.54 20.45,18.03 R4.1
  Bottom 0.254: U4.!RESET 18.46,27.48 17.67,26.68 17.67,20.82 v19.94,18.54
RXI  (via drill 0.38)
  Top 0.254: v17.62,32.93 17.71,32.85 U2.34 21.8,32.85 22.4,33.45 22.92,33.45 23.35,33.02 J5.8 | v8.26,9.53 7.49,8.76 U3.2
  Bottom 0.254: v17.62,32.93 15.79,32.93 15.16,32.31 15.16,18.3 18.68,14.79 18.68,9.79 17.42,8.53 9.25,8.53 v8.26,9.53
SCK  (via drill 0.38)
  Top 0.254: v16.51,25.78 15.24,24.51 7.79,24.51 5.97,22.69 U2.13 3.43,22.69 1.27,24.84 J4.3
  Bottom 0.254: U4.SCK 17.82,31.48 16.8,30.47 16.8,26.07 v16.51,25.78
SCL  (via drill 0.38)
  Top 0.254: U2.36 22.24,35.39 v22.32,35.31 | v22.54,32.57 22.89,32.22 22.89,17.78 | 22.89,17.78 22.89,17.03 23.13,16.79 23.13,16.23 22.89,15.99 22.89,14.91 22.48,14.5 22.48,12.19 21.95,11.66 J6.4 17.76,11.66 17.14,11.05 R9.1 | J5.2 22.89,17.78
  Bottom 0.254: v22.32,35.31 22.54,35.09 v22.54,32.57
SDA  (via drill 0.38)
  Top 0.254: v22.49,10.66 J6.3 18.95,10.66 R6.1 | U2.33 22.1,31.58 22.45,31.22 v22.45,16.51
  Bottom 0.254: v22.49,10.66 22.29,10.86 22.29,16.34 v22.45,16.51 22.86,16.51 J5.1
SHIELD  (via drill 0.38)
  Top 0.254: J1.SHIELD6 15.4,5.03 J1.SHIELD2 | J1.SHIELD8 9.97,5.06 J1.SHIELD
  other vias: 10.54,0.76 14.86,0.76
  pour Top (isolate 0.305): 8.76,0 8.76,5.97 10.79,5.97 10.79,3.56 14.61,3.56 14.61,5.97 16.64,5.97 16.64,0.13 16.51,0
  pour Bottom (isolate 0.305): 16.64,0 16.64,5.97 14.61,5.97 14.61,3.56 10.79,3.56 10.79,5.97 8.76,5.97 8.76,0
TXO  (via drill 0.38)
  Top 0.254: v18.31,34.59 18.79,34.12 U2.35 22.69,34.12 J5.9 | U3.3 8.76,9.08 9.27,9.59 v9.27,9.65
  Bottom 0.254: v18.31,34.59 15.7,34.59 14.73,33.63 14.73,18.12 18.16,14.7 18.16,9.91 17.22,8.97 9.96,8.97 v9.27,9.65
V_USB
  Top 0.254: J1.VBUS 11.4,6.22 11.17,6.46 7.07,6.46 6.86,6.66 6.86,8.38 5.39,9.85 U1.1 | C1.1 4.03,9.11 4.47,9.55 U1.1 | U1.3 3.74,11.74 3.54,11.54 3.54,10.05 3.74,9.85 U1.1

### Text on the board
Bottom: v10
tDocu: Jim Lindblom | Owen Lyke